# EAGLE schematic MewPro-ver1.1 (EAGLE 7.1.0)
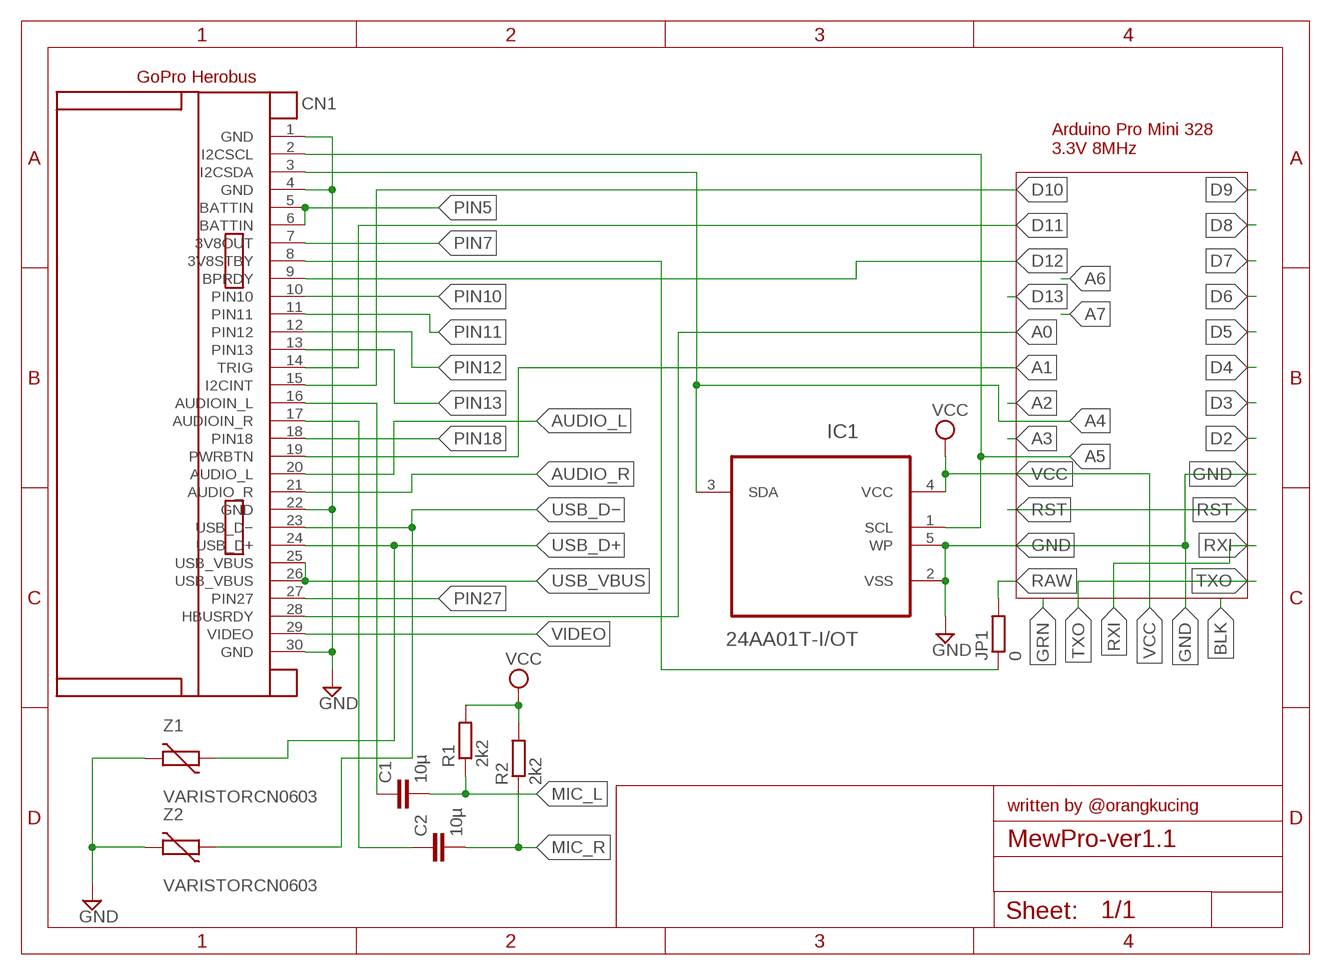
[diagram p0: schematic, sheet 1]

## Parts
C1  10µ  C-EUC0603  [C0603]
C2  10µ  C-EUC0603  [C0603]
CN1  GOPRO-HEROBUS-CONNECTOR  [GOPRO_CONNECTOR]
IC1  24AA01T-I/OT  [SOT95P270X145-5N]
JP1  0  R-EU_R0805  [R0805]
R1  2k2  R-EU_R0603  [R0603]
R2  2k2  R-EU_R0603  [R0603]
Z1  VARISTORCN0603  [CT/CN0603]
Z2  VARISTORCN0603  [CT/CN0603]

## Nets
3V8STBY: CN1.8(3V8STBY) JP1.1
A0: CN1.28(HBUSRDY)
A1: CN1.19(PWRBTN)
A4: CN1.3(I2CSDA) IC1.3(SDA)
A5: CN1.2(I2CSCL) IC1.1(SCL)
AUDIO_L: CN1.20(AUDIO_L)
AUDIO_R: CN1.21(AUDIO_R)
D10: CN1.15(I2CINT)
D11: CN1.14(TRIG)
D12: CN1.9(BPRDY)
GND: CN1.1(GND) CN1.4(GND) CN1.22(GND) CN1.30(GND) IC1.2(VSS) IC1.5(WP) Z1.2 Z2.2
MIC_L: C1.2 R1.1
MIC_R: C2.2 R2.1
N$3: C1.1 CN1.16(AUDIOIN_L)
N$4: C2.1 CN1.17(AUDIOIN_R)
PIN5: CN1.5(BATTIN) CN1.6(BATTIN)
PIN7: CN1.7(3V8OUT)
PIN10: CN1.10(PIN10)
PIN11: CN1.11(PIN11)
PIN12: CN1.12(PIN12)
PIN13: CN1.13(PIN13)
PIN18: CN1.18(PIN18)
PIN27: CN1.27(PIN27)
RAW: JP1.2
USB_D+: CN1.24(USB_D+) Z1.1
USB_D−: CN1.23(USB_D−) Z2.1
USB_VBUS: CN1.25(USB_VBUS) CN1.26(USB_VBUS)
VCC: IC1.4(VCC) R1.2 R2.2
VIDEO: CN1.29(VIDEO)

## Notes on the sheet
- GoPro Herobus
- Arduino Pro Mini 328
  3.3V 8MHz
- written by @orangkucing

## Library data of the parts
C1 C2 = resistor:C-EU: CAPACITOR, European symbol; SPICEPREFIX: C
CN1 = con-gopro:GOPRO-HEROBUS-CONNECTOR
IC1 = Microchip_By_element14_Batch_1:24AA01T-I/OT: EEPROM; DESCRIPTION: Serial EEPROM; MPN: 24AA01T-I/OT; OC_FARNELL: 1331269; OC_NEWARK: 72C4376; PACKAGE: SOT-5; SUPPLIER: Microchip
JP1 R1 R2 = resistor:R-EU_: RESISTOR, European symbol; SPICEPREFIX: R
Z1 Z2 = varistor:VARISTOR: VARISTOR